# Altium schematic sheet CTR_Top.SchDoc: Top Schematic
size A4; DrawnBy: Andrei Divinagracia; Revision: 0A; SheetNumber: 1; SheetTotal: 10
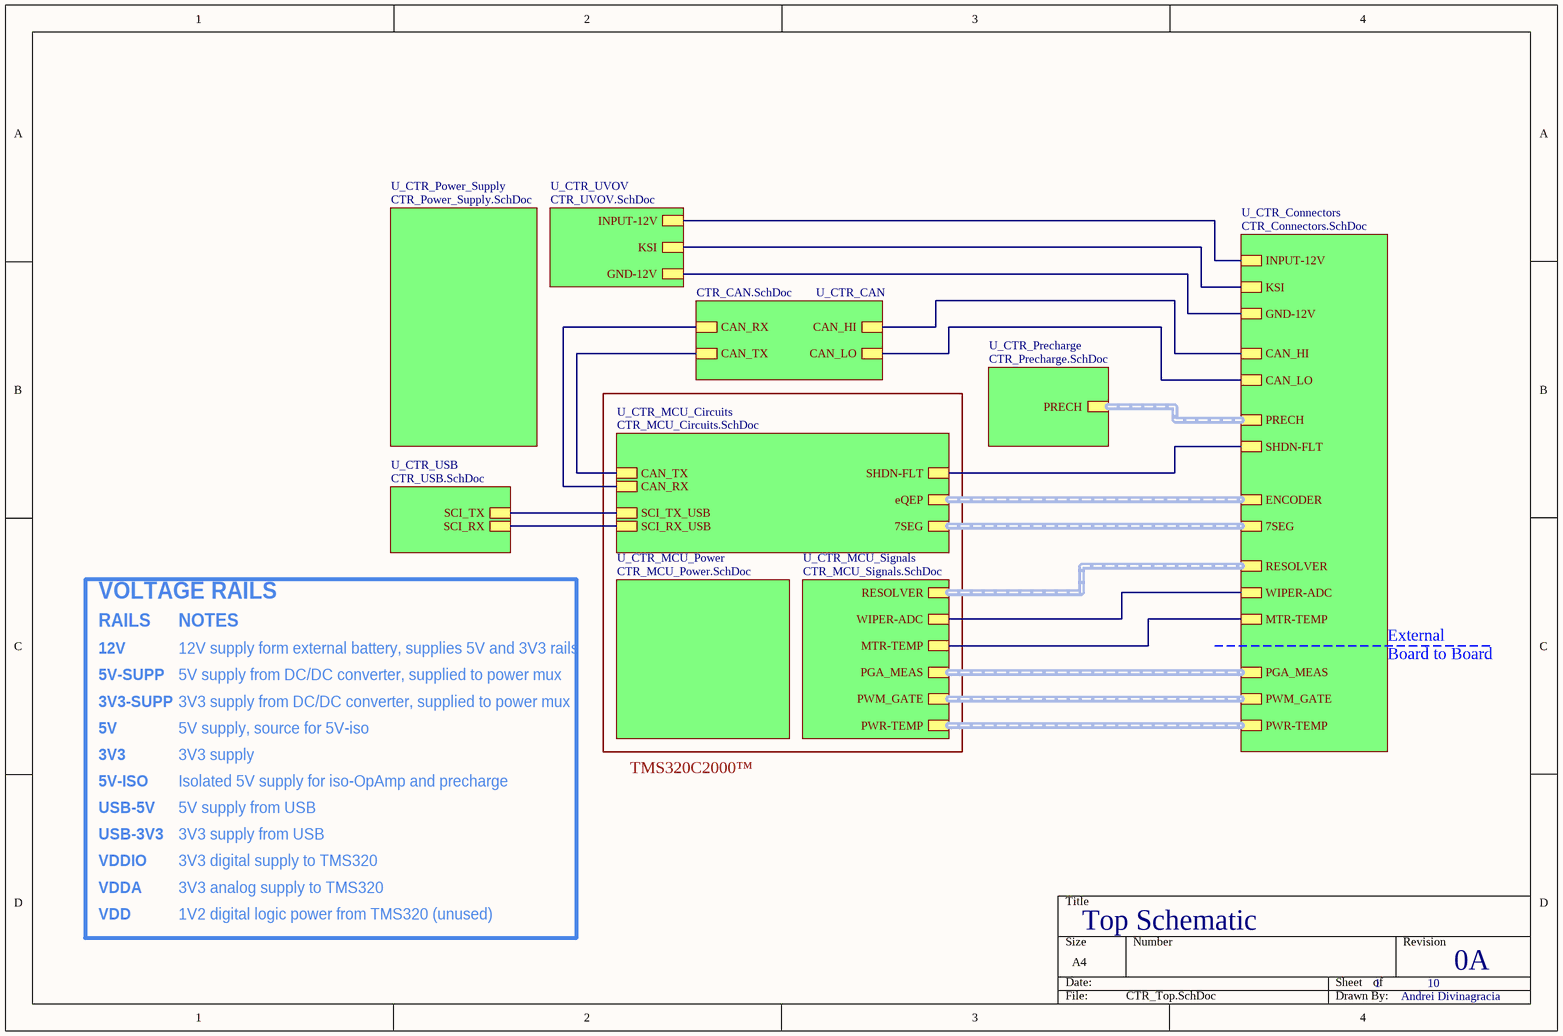
[diagram p0: CTR_Top.SchDoc]

## Sub-sheets
U_CTR_CAN = CTR_CAN.SchDoc: CAN_TX, CAN_RX, CAN_HI, CAN_LO
U_CTR_Connectors = CTR_Connectors.SchDoc: CAN_HI, CAN_LO, KSI, INPUT-12V, MTR-TEMP, GND-12V, WIPER-ADC, ENCODER (harness eQEP-Harness), PGA_MEAS (harness SNS-Harness), PWR-TEMP (harness TEMP-Harness), PWM_GATE (harness GATE-Harness), RESOLVER (harness RESL-Harness), SHDN-FLT, 7SEG (harness 7SEG-Harness), PRECH (harness PRECH-Harness)
U_CTR_MCU_Circuits = CTR_MCU_Circuits.SchDoc: CAN_TX, CAN_RX, SCI_TX_USB, SCI_RX_USB, SHDN-FLT, eQEP (harness eQEP-Harness), 7SEG (harness GPIO-Harness)
U_CTR_MCU_Power = CTR_MCU_Power.SchDoc: no entries
U_CTR_MCU_Signals = CTR_MCU_Signals.SchDoc: MTR-TEMP, WIPER-ADC, PGA_MEAS (harness SNS-Harness), PWR-TEMP (harness TEMP-Harness), PWM_GATE (harness GATE-Harness), RESOLVER (harness RESL-Harness)
U_CTR_Power_Supply = CTR_Power_Supply.SchDoc: no entries
U_CTR_Precharge = CTR_Precharge.SchDoc: PRECH (harness PRECH-Harness)
U_CTR_USB = CTR_USB.SchDoc: SCI_TX, SCI_RX
U_CTR_UVOV = CTR_UVOV.SchDoc: INPUT-12V, KSI, GND-12V

## Nets
(unnamed): sheet U_CTR_CAN/CAN_TX, sheet U_CTR_MCU_Circuits/CAN_TX
(unnamed): sheet U_CTR_CAN/CAN_RX, sheet U_CTR_MCU_Circuits/CAN_RX
(unnamed): sheet U_CTR_CAN/CAN_HI, sheet U_CTR_Connectors/CAN_HI
(unnamed): sheet U_CTR_CAN/CAN_LO, sheet U_CTR_Connectors/CAN_LO
(unnamed): sheet U_CTR_USB/SCI_TX, sheet U_CTR_MCU_Circuits/SCI_TX_USB
(unnamed): sheet U_CTR_USB/SCI_RX, sheet U_CTR_MCU_Circuits/SCI_RX_USB
(unnamed): sheet U_CTR_MCU_Circuits/SHDN-FLT, sheet U_CTR_Connectors/SHDN-FLT
(unnamed): sheet U_CTR_MCU_Signals/MTR-TEMP, sheet U_CTR_Connectors/MTR-TEMP
(unnamed): sheet U_CTR_MCU_Signals/WIPER-ADC, sheet U_CTR_Connectors/WIPER-ADC
(unnamed): sheet U_CTR_Connectors/KSI, sheet U_CTR_UVOV/KSI
(unnamed): sheet U_CTR_Connectors/INPUT-12V, sheet U_CTR_UVOV/INPUT-12V
(unnamed): sheet U_CTR_Connectors/GND-12V, sheet U_CTR_UVOV/GND-12V

## Buses and harness runs
harness sheet U_CTR_Connectors/7SEG = sheet U_CTR_MCU_Circuits/7SEG
harness sheet U_CTR_Connectors/ENCODER = sheet U_CTR_MCU_Circuits/eQEP
harness sheet U_CTR_Connectors/PGA_MEAS = sheet U_CTR_MCU_Signals/PGA_MEAS
harness sheet U_CTR_Connectors/PRECH = sheet U_CTR_Precharge/PRECH
harness sheet U_CTR_Connectors/PWM_GATE = sheet U_CTR_MCU_Signals/PWM_GATE
harness sheet U_CTR_Connectors/PWR-TEMP = sheet U_CTR_MCU_Signals/PWR-TEMP
harness sheet U_CTR_Connectors/RESOLVER = sheet U_CTR_MCU_Signals/RESOLVER

## Notes on the sheet
- VOLTAGE RAILS
- 12V
- RAILS
- NOTES
- 12V supply form external battery, supplies 5V and 3V3 rails
- External
- 5V-SUPP
- 3V3-SUPP
- 5V supply from DC/DC converter, supplied to power mux
- 3V3 supply from DC/DC converter, supplied to power mux
- Board to Board
- 5V
- 3V3
- 5V-ISO
- 5V supply, source for 5V-iso
- Isolated 5V supply for iso-OpAmp and precharge
- 3V3 supply
- TMS320C2000™
- USB-5V
- USB-3V3
- 5V supply from USB
- 3V3 supply from USB
- VDD
- VDDIO
- VDDA
- 3V3 digital supply to TMS320
- 3V3 analog supply to TMS320
- 1V2 digital logic power from TMS320 (unused)